# EAGLE design BSPD (EAGLE 8.2.2)

## Sheet 1 of 2
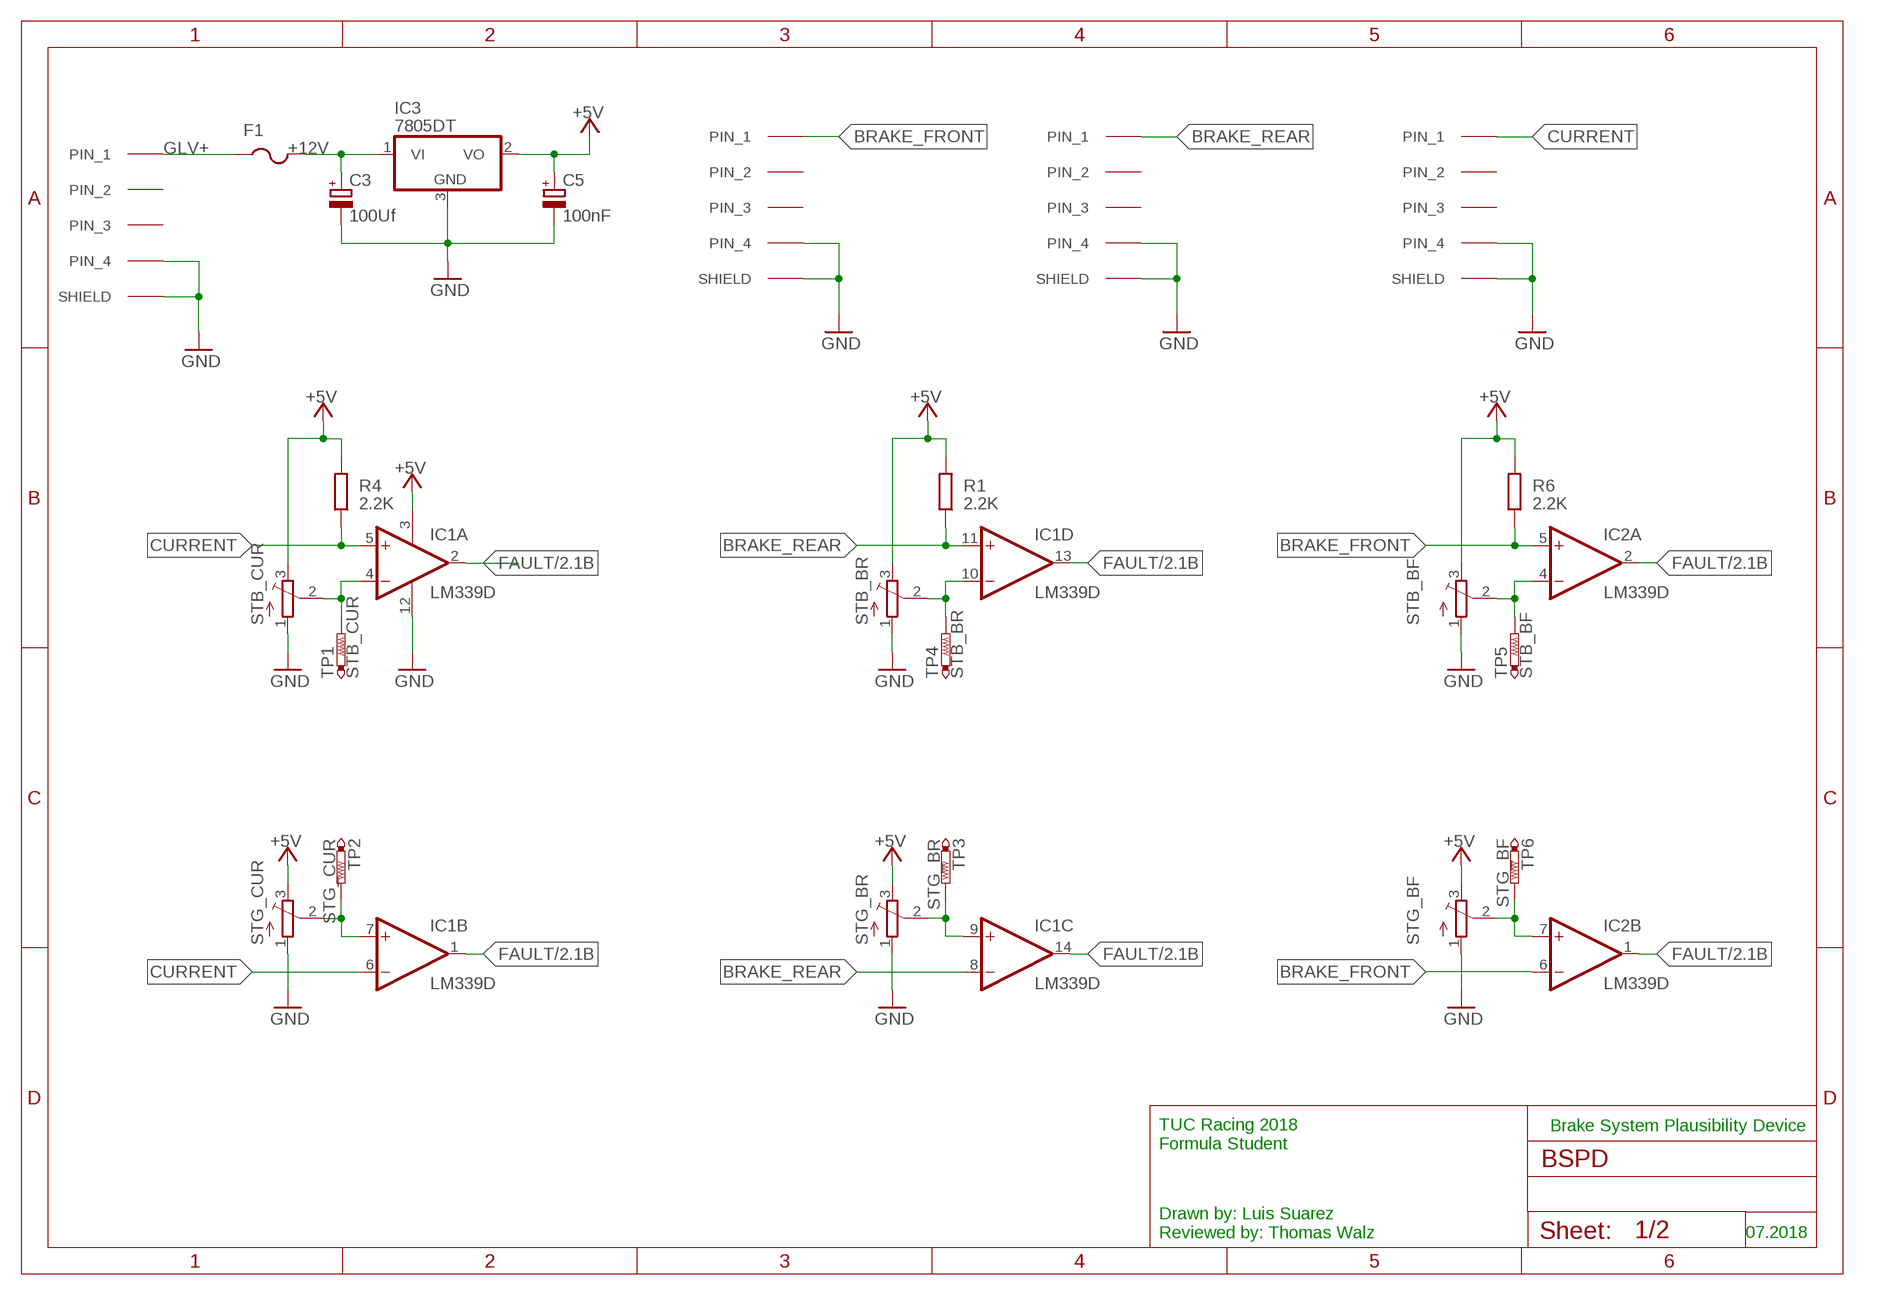
[diagram p0: schematic, sheet 1]

### Parts
C3  100Uf  CPOL-EUD  [PANASONIC_D]
C5  100nF  CPOL-EUC  [PANASONIC_C]
F1  PTCFUSE-1206  [R1206]
IC1  LM339D  [SO14]
IC2  LM339D  [SO14]
IC3  7805DT  [TO252]
POWER  M8-718-MALE  [M18-718-MALE]
POWER1  M8-718-MALE  [M18-718-MALE]
POWER2  M8-718-MALE  [M18-718-MALE]
POWER3  M8-718-MALE  [M18-718-MALE]
R1  2.2K  R-EU_R0805  [R0805]
R4  2.2K  R-EU_R0805  [R0805]
R6  2.2K  R-EU_R0805  [R0805]
STB_BF  TRIM_EU-SM-42/43B  [SM-42/43B]
STB_BR  TRIM_EU-SM-42/43B  [SM-42/43B]
STB_CUR  TRIM_EU-SM-42/43B  [SM-42/43B]
STG_BF  TRIM_EU-SM-42/43B  [SM-42/43B]
STG_BR  TRIM_EU-SM-42/43B  [SM-42/43B]
STG_CUR  TRIM_EU-SM-42/43B  [SM-42/43B]
TP1  PTR1PAD1-13  [P1-13]
TP2  PTR1PAD1-13  [P1-13]
TP3  PTR1PAD1-13  [P1-13]
TP4  PTR1PAD1-13  [P1-13]
TP5  PTR1PAD1-13  [P1-13]
TP6  PTR1PAD1-13  [P1-13]

### Nets
+5V: C5.+ IC1.3(P:V+) IC3.2(VO) R1.2 R4.2 R6.2 STB_BF.3(E) STB_BR.3(E) STB_CUR.3(E) STG_BF.3(E) STG_BR.3(E) STG_CUR.3(E) ; also sheet 2
+12V: C3.+ F1.2 IC3.1(VI)
BRAKE_FRONT: IC2.5(A:+IN) IC2.6(B:-IN) POWER1.P$1(PIN_1) R6.1
BRAKE_REAR: IC1.8(C:-IN) IC1.11(D:+IN) POWER2.P$1(PIN_1) R1.1
CURRENT: IC1.5(A:+IN) IC1.6(B:-IN) POWER3.P$1(PIN_1) R4.1
FAULT: IC1.1(B:OUT) IC1.2(A:OUT) IC1.13(D:OUT) IC1.14(C:OUT) IC2.1(B:OUT) IC2.2(A:OUT) ; also sheet 2
GLV+: F1.1 POWER.P$1(PIN_1) ; also sheet 2
GND: C3.- C5.- IC1.12(P:GND) IC3.3(GND) POWER1.L(SHIELD) POWER1.P$4(PIN_4) POWER1.R(SHIELD) POWER2.L(SHIELD) POWER2.P$4(PIN_4) POWER2.R(SHIELD) POWER3.L(SHIELD) POWER3.P$4(PIN_4) POWER3.R(SHIELD) POWER.L(SHIELD) POWER.P$4(PIN_4) POWER.R(SHIELD) STB_BF.1(A) STB_BR.1(A) STB_CUR.1(A) STG_BF.1(A) STG_BR.1(A) STG_CUR.1(A) ; also sheet 2
STB_BF_TH: IC2.4(A:-IN) STB_BF.2(S) TP5.TP
STB_BR_TH: IC1.10(D:-IN) STB_BR.2(S) TP4.TP
STB_CUR_TH: IC1.4(A:-IN) STB_CUR.2(S) TP1.TP
STG_BR_TH: IC1.9(C:+IN) STG_BR.2(S) TP3.TP
STG_CUR_TH: IC1.7(B:+IN) STG_CUR.2(S) TP2.TP
TP_STG_BF: IC2.7(B:+IN) STG_BF.2(S) TP6.TP
Unconnected: POWER1.P$2(PIN_2) POWER1.P$3(PIN_3) POWER2.P$2(PIN_2) POWER2.P$3(PIN_3) POWER3.P$2(PIN_2) POWER3.P$3(PIN_3) POWER.P$2(PIN_2) POWER.P$3(PIN_3)

### Notes on the sheet
- Brake System Plausibility Device
- TUC Racing 2018
  Formula Student
- Drawn by: Luis Suarez
  Reviewed by: Thomas Walz
- 07.2018

## Sheet 2 of 2
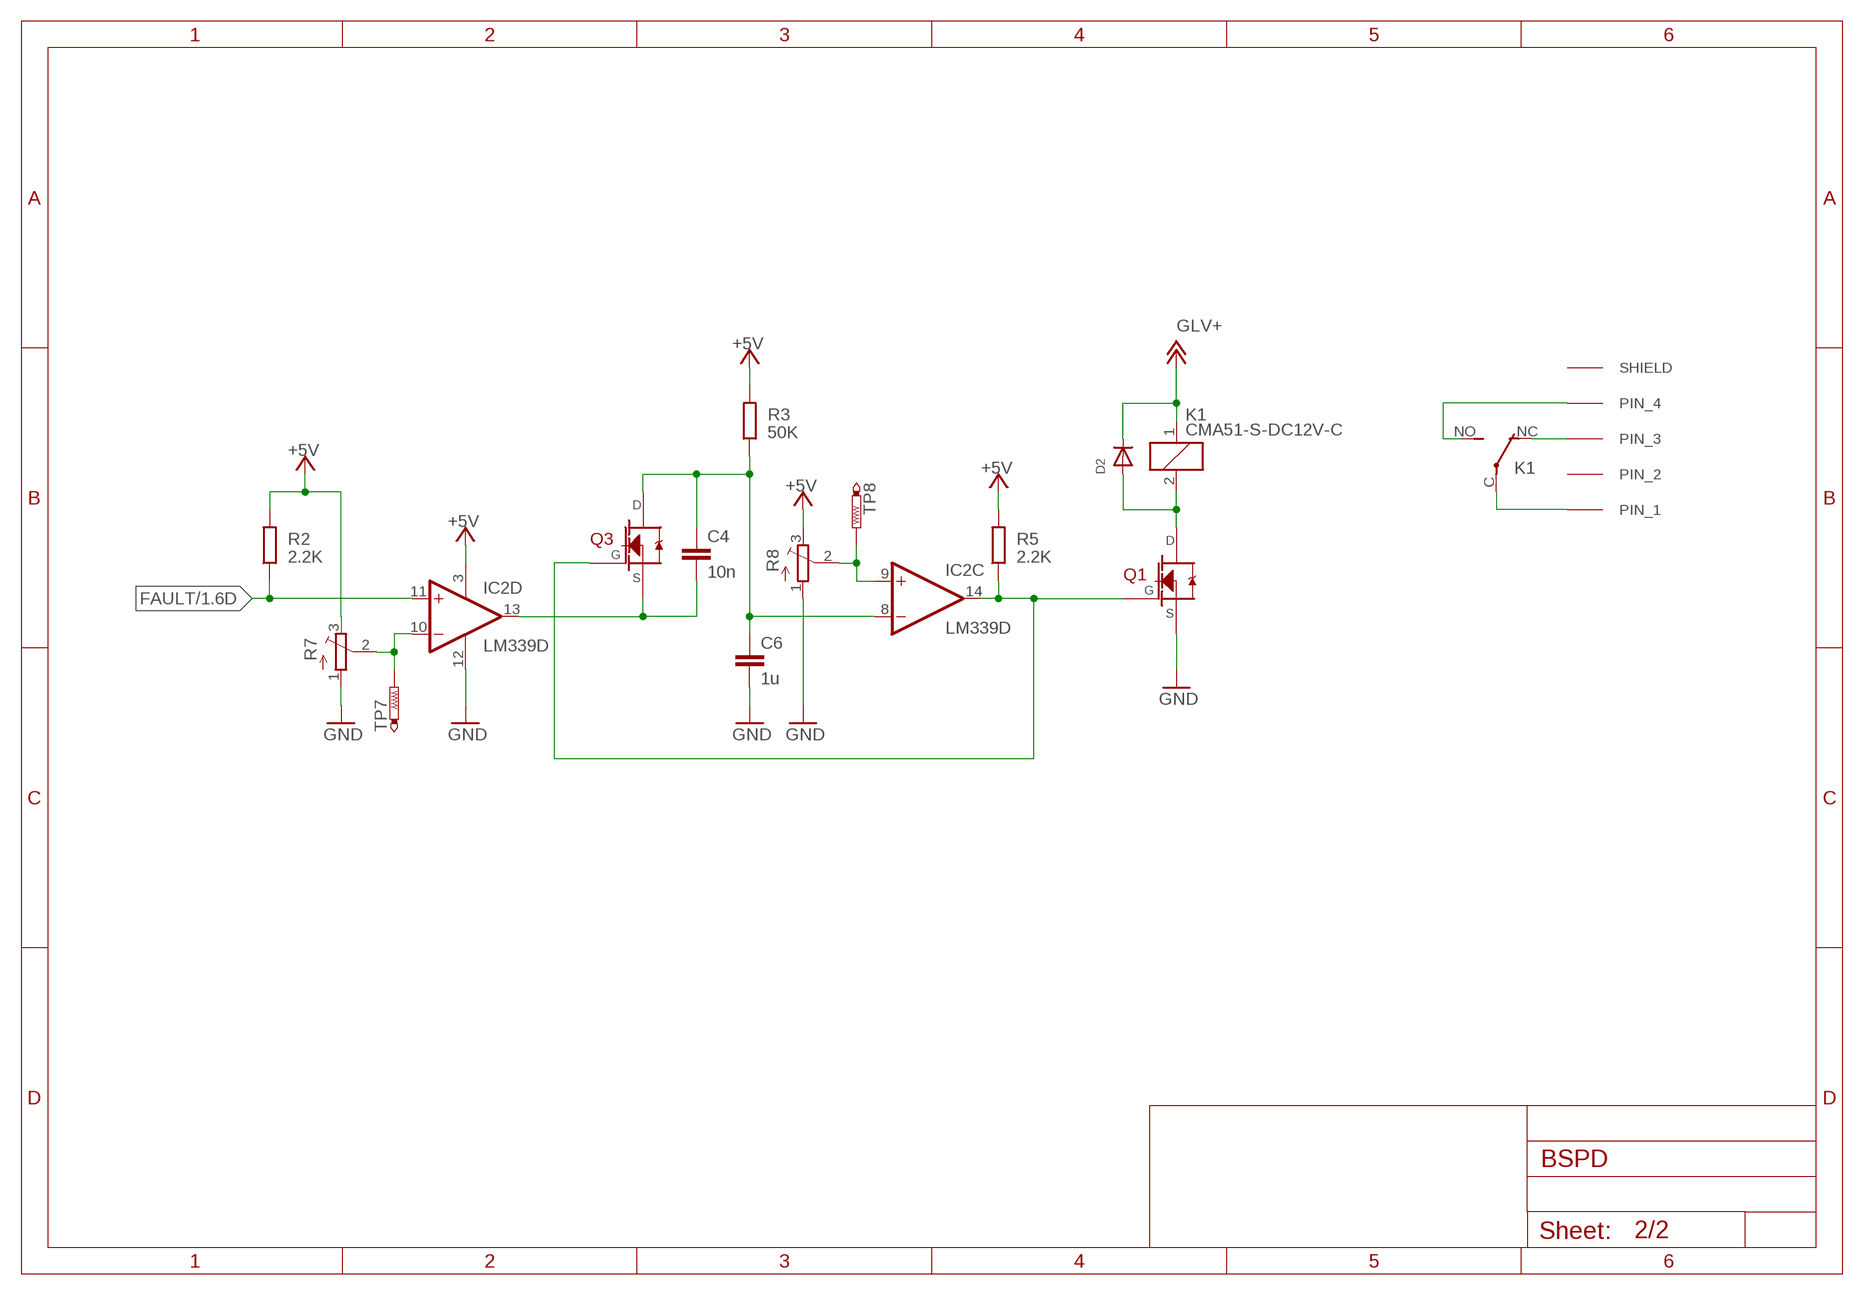
[diagram p1: schematic, sheet 2]

### Parts
C4  10n  C-EUC1210  [C1210]
C6  1u  C-EUC1210  [C1210]
D2  DIODESOD-123  [SOD-123]
K1  CMA51-S-DC12V-C  CQ1-12V  [CQ1]
Q1  INF-PG-TDSON-8-1_V_1  [INF-PG-TDSON-8-1_V_1PRIMARY]
Q3  INF-PG-TDSON-8-1_V_1  [INF-PG-TDSON-8-1_V_1PRIMARY]
R2  2.2K  R-EU_R0805  [R0805]
R3  50K  R-EU_R0805  [R0805]
R5  2.2K  R-EU_R0805  [R0805]
R7  TRIM_EU-SM-42/43B  [SM-42/43B]
R8  TRIM_EU-SM-42/43B  [SM-42/43B]
TP7  PTR1PAD1-13  [P1-13]
TP8  PTR1PAD1-13  [P1-13]
U$1  M8-718-MALE  [M18-718-MALE]

### Nets
+5V: IC2.3(P:V+) R2.2 R3.2 R5.2 R7.3(E) R8.3(E) ; also sheet 1
BSPD+: K1.NO(2:S) U$1.P$4(PIN_4)
BSPD-: K1.C(2:P) U$1.P$1(PIN_1)
FAULT: IC2.11(D:+IN) R2.1 ; also sheet 1
FAULT_STATE: C4.2 IC2.13(D:OUT) Q3.1(S) Q3.2(S) Q3.3(S)
GLV+: D2.C K1.1 ; supply symbol labelled +12V ; also sheet 1
GND: C6.2 IC2.12(P:GND) Q1.1(S) Q1.2(S) Q1.3(S) R7.1(A) R8.1(A) ; also sheet 1
N$1: D2.A K1.2 Q1.5(D) Q1.6(D) Q1.7(D) Q1.8(D)
N$3: K1.NC(2:O) U$1.P$3(PIN_3)
N$15: IC2.10(D:-IN) R7.2(S) TP7.TP
N$16: IC2.9(C:+IN) R8.2(S) TP8.TP
N$28: C4.1 C6.1 IC2.8(C:-IN) Q3.5(D) Q3.6(D) Q3.7(D) Q3.8(D) R3.1
OUT_STATUS: IC2.14(C:OUT) Q1.4(G) Q3.4(G) R5.1
Unconnected: U$1.L(SHIELD) U$1.P$2(PIN_2) U$1.R(SHIELD)

## Library data of the parts
C3 C5 = rcl:CPOL-EU: POLARIZED CAPACITOR, European symbol
C4 C6 = rcl:C-EU: CAPACITOR, European symbol
D2 = adafruit:DIODE: Diode SMADIODE - SMA Surface Mount Package 20V 1A Schottky Diode Digikey: 641-1014-6-ND DO-1N4148 - Through Hole Small Current Diode SOD-123 20V 1 A (.5mV Vf) Schottky Diode - Digikey: MBRX120TPMSCT-ND SOD-323 10V 570mA (.38mV Vf, 3ns) Schottky Diode - Digikey: ZLLS410CT-ND SOD-523 30V 30mA Schottky Diode (RB751S-40TE61) - Digikey: RB751S-40TE61CT-ND SOT23-R/W - SOT23 Package (R = Solder Paste/Reflow Ovens, W = Hand-Soldering) BAT54Film 40V 300mA - Digikey: 497-7162-1-ND
F1 = adafruit:PTCFUSE: PTC fuses, resettable thermistors
IC1 IC2 = linear:LM339: Low Power Low Offset Voltage Quad Comparators with open collector; LM139/LM239/LM339/LM2901/LM3302
IC3 = linear:78*: Positive VOLTAGE REGULATOR Source: http://cache.national.com/ds/LM/LM78L05.pdf http://www.fairchildsemi.com/ds/LM/LM7805.pdf
K1 = relay:CQ1-12V: AUTOMOTIVE QUIET RELAY NAiS Source: http://www.mew-europe.com/.. en_ds_61208_0000.pdf; OC_FARNELL: unknown; OC_NEWARK: unknown
POWER = SamacSys_Parts:M8-718-MALE; LABEL: POWER
POWER1 = SamacSys_Parts:M8-718-MALE; LABEL: BRAKE_FRONT
POWER2 = SamacSys_Parts:M8-718-MALE; LABEL: BRAKE_REAR
POWER3 = SamacSys_Parts:M8-718-MALE; LABEL: CURRENT
Q1 Q3 = INF-PG-TDSON-8-1_V:INF-PG-TDSON-8-1_V_1
R1-R6 = resistor:R-EU_: RESISTOR, European symbol
R7 R8 STB_BF STB_BR STB_CUR STG_BF STG_BR STG_CUR = pot:TRIM_EU-: POTENTIOMETER
TP1 = testpad:PTR1: TEST PIN; TP_SIGNAL_NAME: STB_CUR
TP2 = testpad:PTR1: TEST PIN; TP_SIGNAL_NAME: STG_CUR
TP3 = testpad:PTR1: TEST PIN; TP_SIGNAL_NAME: STG_BR
TP4 = testpad:PTR1: TEST PIN; TP_SIGNAL_NAME: STB_BR
TP5 = testpad:PTR1: TEST PIN; TP_SIGNAL_NAME: STB_BF
TP6 = testpad:PTR1: TEST PIN; TP_SIGNAL_NAME: STG_BF
TP7 TP8 = testpad:PTR1: TEST PIN
U$1 = SamacSys_Parts:M8-718-MALE; LABEL: OUTPUT

## Board
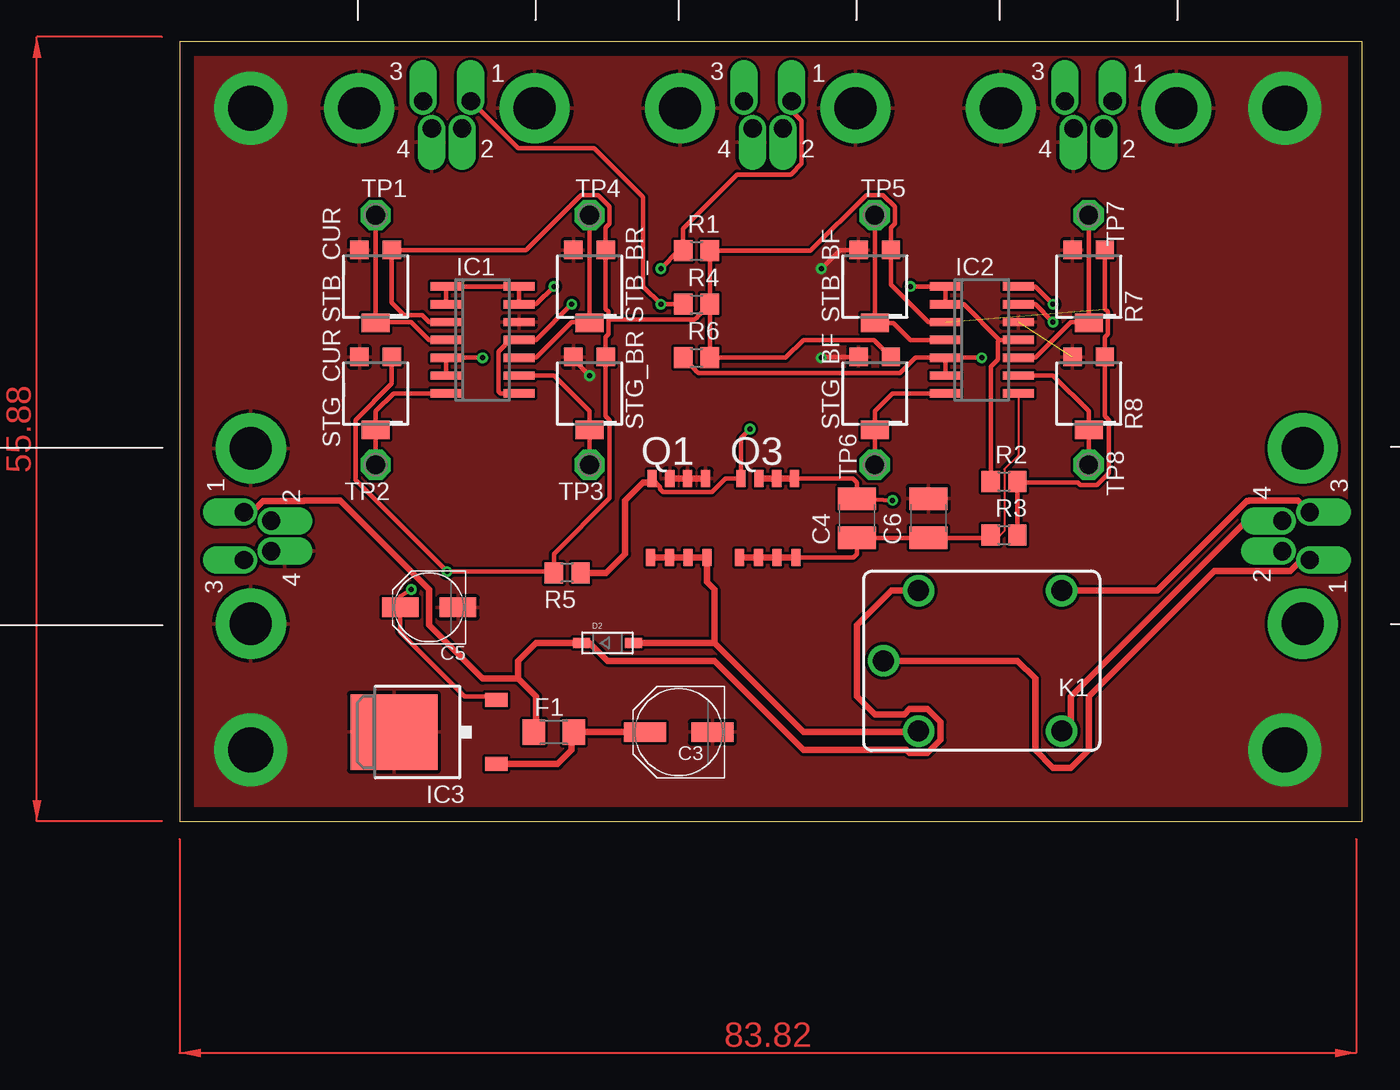
[diagram p2: board, top side]
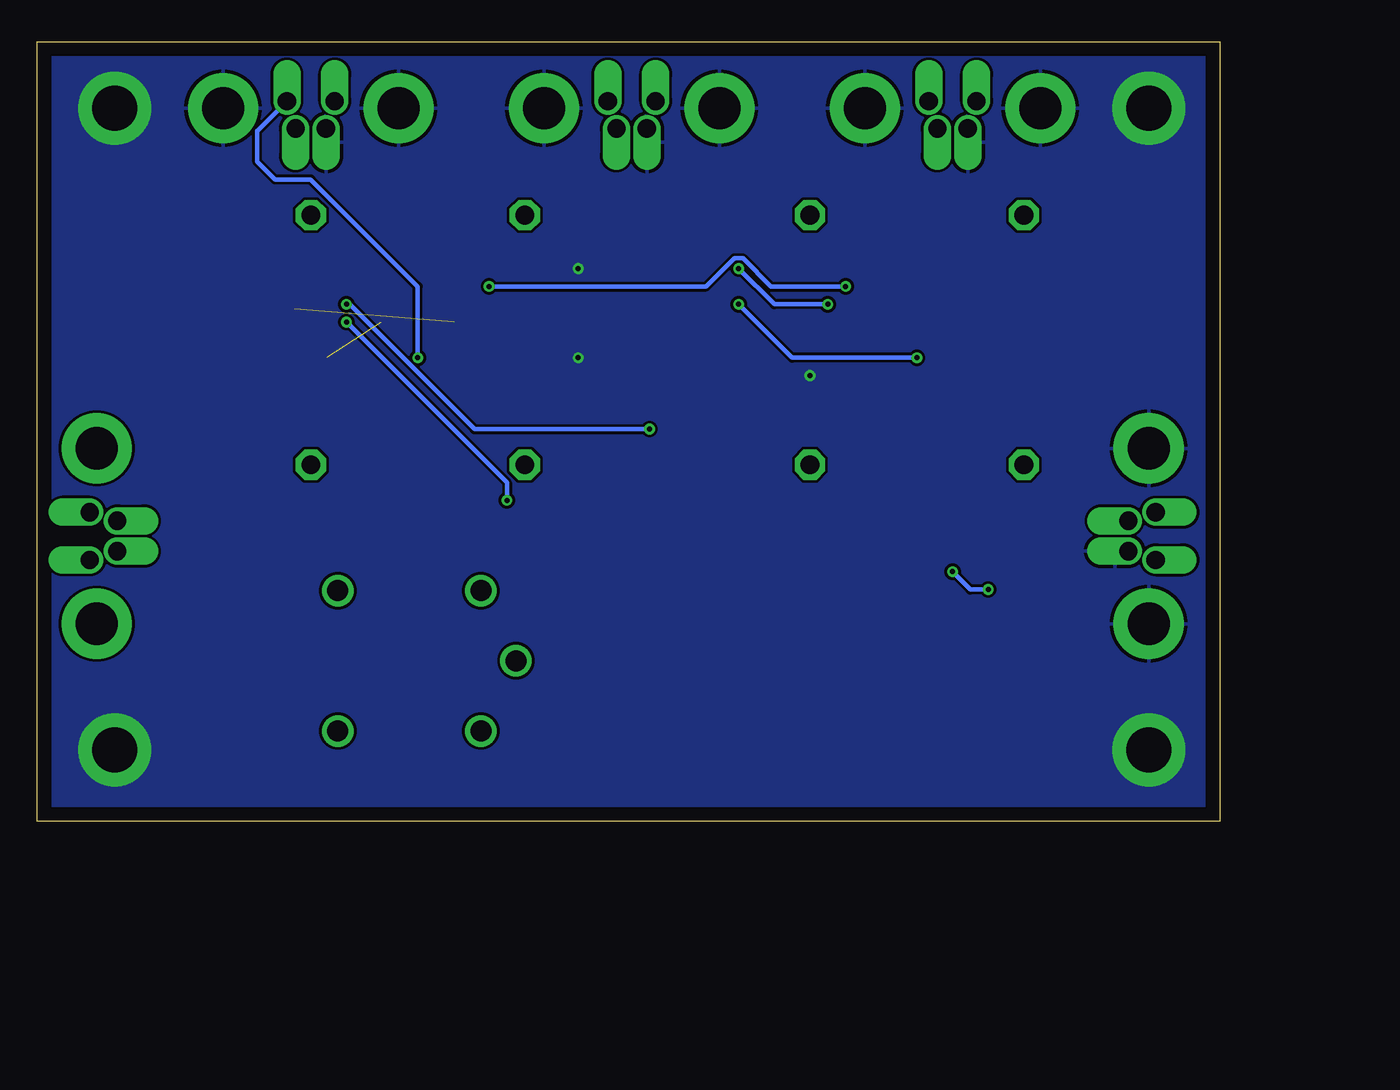
[diagram p3: board, bottom side, seen from below]

Size 84.27 x 55.55 mm. Coordinates in mm from the lower left corner, seen from the top.
Outline: 0,0 84.27,0 84.27,55.55 0,55.55 0,0
Copper layers (1*16): Top 0.035mm / dielectric 1.5mm / Bottom 0.035mm
Design rules "default": minimum track width 10mil, minimum drill 24mil, track to track 8mil, track to pad 8mil, pad to pad 8mil, via to via 8mil, smd to smd 8mil, copper to edge 40mil, drill to drill 8mil, minimum pad ring 10mil, minimum via ring 8mil, stop-mask expansion 4mil, vias tented up to drill 0mil, thermal gap 10mil

### Footprints (pad centres in the part's own frame; a part is rotated, then mirrored left to right if it is on the bottom)
PANASONIC_D = smd 3 x 1.4: + 2.4,0; - -2.4,0
C1210 = smd 1.6 x 2.7: 1 -1.4,0; 2 1.4,0
PANASONIC_C = smd 2.6 x 1.4: + 2.05,0; - -2.05,0
SOD-123 = smd 1.2 x 0.7: A 1.85,0; C -1.85,0
R1206 = smd 1.6 x 1.803: 1 -1.422,0; 2 1.422,0
SO14 = smd 0.6 x 2.2: 1 -3.81,-2.6; 2 -2.54,-2.6; 3 -1.27,-2.6; 4 0,-2.6; 5 1.27,-2.6; 6 2.54,-2.6; 7 3.81,-2.6; 8 3.81,2.6; 9 2.54,2.6; 10 1.27,2.6; 11 0,2.6; 12 -1.27,2.6; 13 -2.54,2.6; 14 -3.81,2.6
TO252 = smd 1 x 1.6: 1 -2.28,-4.8; 2 2.28,-4.8 | smd 5.4 x 6.2: 3 0,2.5
CQ1 = drill 1.5: 1 4.5,-5; 2 4.5,5; C 7,0; NC -5.7,-5; NO -5.7,5
M18-718-MALE = drill 3 pad 5: L -6.25,0; R 6.25,0 | drill 1.3 pad 1.8 offset: P$1 -1.7,-0.5; P$2 -1.08,1.45; P$3 1.7,-0.5; P$4 1.08,1.45
INF-PG-TDSON-8-1_V_1PRIMARY = smd 0.65 x 1.2: 1 -1.905,-2.825; 2 -0.635,-2.825; 3 0.635,-2.825; 4 1.905,-2.825; 5 2.007,2.794; 6 0.66,2.794; 7 -0.66,2.794; 8 -2.007,2.794
R0805 = smd 1.3 x 1.5: 1 -0.95,0; 2 0.95,0
SM-42/43B = smd 1.3 x 1.3: 1 2.6,1.15; 3 2.6,-1.15 | smd 1.3 x 2: 2 -2.6,0
P1-13 = drill 1.321 pad 2.159 octagon: TP 0,0

### Placement (x,y rotation side)
C3  35.56,6.35 180 top
C4  48.26,21.59 90 top
C5  17.78,15.24 180 top
C6  53.34,21.59 90 top
D2  30.48,12.7 0 top
F1  26.67,6.35 0 top
IC1  21.59,34.29 270 top
IC2  57.15,34.29 270 top
IC3  17.78,6.35 90 top
K1  57.15,11.43 180 top
POWER  5.08,20.32 270 top
POWER1  64.77,50.8 180 top
POWER2  41.91,50.8 180 top
POWER3  19.05,50.8 180 top
Q1  35.56,21.59 180 top
Q3  41.91,21.59 180 top
R1  36.83,40.64 0 top
R2  58.74,24.21 0 top
R3  58.74,20.4 0 top
R4  36.83,36.83 0 top
R5  27.62,17.7 180 top
R6  36.83,33.02 0 top
R7  64.77,38.1 90 top
R8  64.77,30.48 90 top
STB_BF  49.53,38.1 90 top
STB_BR  29.21,38.1 90 top
STB_CUR  13.97,38.1 90 top
STG_BF  49.53,30.48 90 top
STG_BR  29.21,30.48 90 top
STG_CUR  13.97,30.48 90 top
TP1  13.97,43.18 0 top
TP2  13.97,25.4 180 top
TP3  29.21,25.4 180 top
TP4  29.21,43.18 0 top
TP5  49.53,43.18 0 top
TP6  49.53,25.4 90 top
TP7  64.77,43.18 270 top
TP8  64.77,25.4 270 top
U$1  80.01,20.32 90 top

### Tracks (layer width: path | path; a pad name or v marks a point on that pad's centre or on a via)
+5V  (via drill 0.35)  (1 unrouted)
  Top 0.305: IC3.2 22.32,8.89 20.32,8.89 15.73,13.48 C5.+ 15.73,16.02 v16.51,16.51 | 38.36,40.7 R1.2 | 30.57,35.65 30.57,36.3 30.36,36.5 STB_BR.3 30.36,42.3 30.64,42.59 30.64,43.77 29.8,44.62 28.62,44.62 24.7,40.7 STB_CUR.3 15.12,36.95 16,36.07 17.27,36.07 17.78,35.56 IC1.3 | 30.57,35.65 30.57,34.7 30.36,34.5 STG_BR.3 30.36,28.88 30.64,28.6 30.64,23.02 26.67,19.05 R5.2 26.59,17.78 v19.05,17.78 12.54,24.3 12.54,28.6 15.12,31.18 STG_CUR.3 | 59.69,24.12 R3.2 | 59.69,24.12 R2.2 | R7.3 65.92,36.5 66.13,36.3 66.13,34.7 65.92,34.5 R8.3 65.92,28.88 66.2,28.6 66.2,24.81 65.36,23.96 64.18,23.96 64.01,24.13 59.7,24.13 59.69,24.12 | IC2.3 53.34,35.56 50.68,38.22 STB_BF.3 50.68,42.3 50.97,42.59 50.97,43.77 50.12,44.62 48.94,44.62 44.96,40.64 R1.2 | R4.2 R6.2 43.18,33.02 44.45,34.29 49.47,34.29 STG_BF.3 | R1.2 R4.2 | R4.2 36.89,35.94 36.89,35.93 36.68,35.72 30.64,35.72 30.57,35.65
  Bottom 0.305: v16.51,16.51 17.78,16.51 v19.05,17.78
+12V
  Top 0.457: IC3.1 26.93,4.07 27.94,5.08 27.94,6.2 F1.2 C3.+
BRAKE_FRONT  (via drill 0.35)
  Top 0.305: IC2.6 IC2.5 | IC2.5 52.42,33.02 51.32,31.91 36.98,31.91 36.77,32.12 36.77,32.13 R6.1 | IC2.5 v57.15,33.02
  Bottom 0.305: v57.15,33.02 57.15,38.1 64.77,45.72 67.31,45.72 68.58,46.99 68.58,49.2 68.57,49.2 POWER1.P$1
BRAKE_REAR  (via drill 0.35)
  Top 0.305: POWER2.P$1 43.61,50.61 44.32,49.9 44.32,46.85 43.54,46.07 39.72,46.07 35.88,42.23 R1.1 35.56,40.64 v34.29,39.37 | v27.94,36.83 25.4,34.29 IC1.11 23.56,34.29 22.73,33.47 22.73,30.61 22.86,30.48 IC1.8
  Bottom 0.305: v27.94,36.83 31.75,36.83 v34.29,39.37
BSPD+
  Top 0.457: U$1.P$4 76.01,21.4 63.5,8.89 63.5,7.08 K1.NO
BSPD-
  Top 0.457: U$1.P$1 79.93,18.62 79.14,17.83 73.71,17.83 64.77,8.89 64.77,5.08 63.5,3.81 62.23,3.81 60.96,5.08 60.96,10.16 59.69,11.43 K1.C
CURRENT  (via drill 0.35)
  Top 0.305: IC1.6 IC1.5 v21.59,33.02 | POWER3.P$1 20.76,51.3 24.12,47.94 29.53,47.94 33.02,44.45 33.02,38.1 v34.29,36.83 R4.1
  Bottom 0.305: v21.59,33.02 30.48,33.02 v34.29,36.83
FAULT  (via drill 0.35)
  Top 0.305: IC1.2 IC1.1 IC1.14 IC1.13 25.4,36.83 v26.67,38.1 | 58.42,34.29 IC2.11 | 58.42,34.29 55.88,36.83 IC2.2 IC2.1 v52.07,38.1 | R2.1 57.79,32.39 58.29,32.89 58.29,34.16 58.42,34.29
  Bottom 0.305: v52.07,38.1 36.6,38.1 34.59,40.1 33.99,40.1 31.98,38.1 v26.67,38.1
FAULT_STATE  (via drill 0.35)
  Top 0.305: Q3.1 47.98,24.41 48.26,24.13 C4.2 v50.8,22.86 | IC2.13 60.96,36.83 v62.23,35.56
  Top 0.457: Q3.3 Q3.2 Q3.1
  Bottom 0.305: v62.23,35.56 50.8,24.13 v50.8,22.86
GLV+
  Top 0.457: POWER.P$1 5.16,22.02 5.95,22.81 8.84,22.81 8.89,22.86 11.43,22.86 17.78,16.51 17.78,13.97 21.59,10.16 24.02,10.16 | 24.02,10.16 24.13,10.16 25.4,8.89 25.4,6.5 F1.1 | 24.02,10.16 24.13,10.27 24.13,11.43 25.4,12.7 D2.C 29.21,12.7 30.48,11.43 38.1,11.43 44.45,5.08 51.8,5.08 52.01,4.87 53.3,4.87 54.21,5.79 54.21,7.08 53.3,7.99 52.01,7.99 51.64,7.62 49.53,7.62 48.26,8.89 48.26,13.97 50.72,16.43 K1.1
GND  (via drill 0.35, 3.2 pad 5.2)  (1 unrouted)
  Top 0.305: STG_BF.1 45.78,33.08 v45.72,33.02 | STG_BR.1 28.06,32.9 v29.21,31.75 | STB_BF.1 47.05,40.7 v45.72,39.37
  Top 0.457: Q1.3 Q1.2 Q1.1
  other vias: 5.08,5.08 78.74,5.08 78.74,50.8 5.08,50.8
  pour Bottom: -1.27,57.15 -1.27,-1.27 86.36,-1.27 86.36,57.15
  pour Top: 0,55.88 0,0 83.82,0 85.09,0 85.09,55.88
N$1
  Top 0.457: 38.1,12.7 D2.A | 38.1,12.7 44.45,6.35 52.57,6.35 K1.2 | Q1.5 Q1.6 Q1.7 Q1.8 37.57,17.04 38.1,16.51 38.1,12.7
N$3
  Top 0.457: K1.NC 69.65,16.43 76.03,22.81 76.15,22.81 76.2,22.86 79.67,22.86 U$1.P$3
N$15
  Top 0.305: 64.77,35.53 TP7.TP | 64.77,35.53 R7.2 | IC2.10 60.96,33.02 63.5,35.56 64.74,35.56 64.77,35.53
N$16
  Top 0.305: TP8.TP R8.2 64.77,29.21 62.23,31.75 IC2.9
N$28
  Top 0.152: IC2.8 59.75,26.07 58.76,25.08 58.76,20.66 58.42,20.32 57.87,20.32 R3.1
  Top 0.305: Q3.8 48.01,18.8 48.26,19.05 C4.1 C6.1 57.58,20.19 R3.1
  Top 0.457: Q3.5 Q3.6 Q3.7 Q3.8
OUT_STATUS  (via drill 0.35)
  Top 0.305: Q1.4 34.24,23.83 34.24,23.67 34.45,23.46 37.94,23.46 38.89,24.41 Q3.4 40.01,27.3 v40.64,27.94 | IC2.14 60.96,38.1 v62.23,36.83
  Top 0.457: R5.1 30.4,17.7 31.75,19.05 31.75,22.86 33.02,24.13 33.37,24.13 Q1.4
  Bottom 0.305: v40.64,27.94 53.11,27.94 62,36.83 v62.23,36.83
STB_BF_TH
  Top 0.305: IC2.4 52.07,34.29 50.86,35.5 STB_BF.2 TP5.TP
STB_BR_TH
  Top 0.305: IC1.10 25.4,33.02 27.94,35.56 29.15,35.56 | 29.15,35.56 STB_BR.2 | TP4.TP 29.21,35.62 29.15,35.56
STB_CUR_TH
  Top 0.305: TP1.TP STB_CUR.2 14.03,35.56 16.51,35.56 17.78,34.29 IC1.4
STG_BR_TH
  Top 0.305: TP3.TP STG_BR.2 29.21,29.21 26.67,31.75 IC1.9
STG_CUR_TH
  Top 0.305: 13.97,27.73 STG_CUR.2 | 13.97,27.73 TP2.TP | IC1.7 15.24,30.48 13.97,29.21 13.97,27.73
TP_STG_BF
  Top 0.305: TP6.TP STG_BF.2 49.53,29.21 50.8,30.48 IC2.7
(copper drawn outside any net)
  shapes: Top area x2